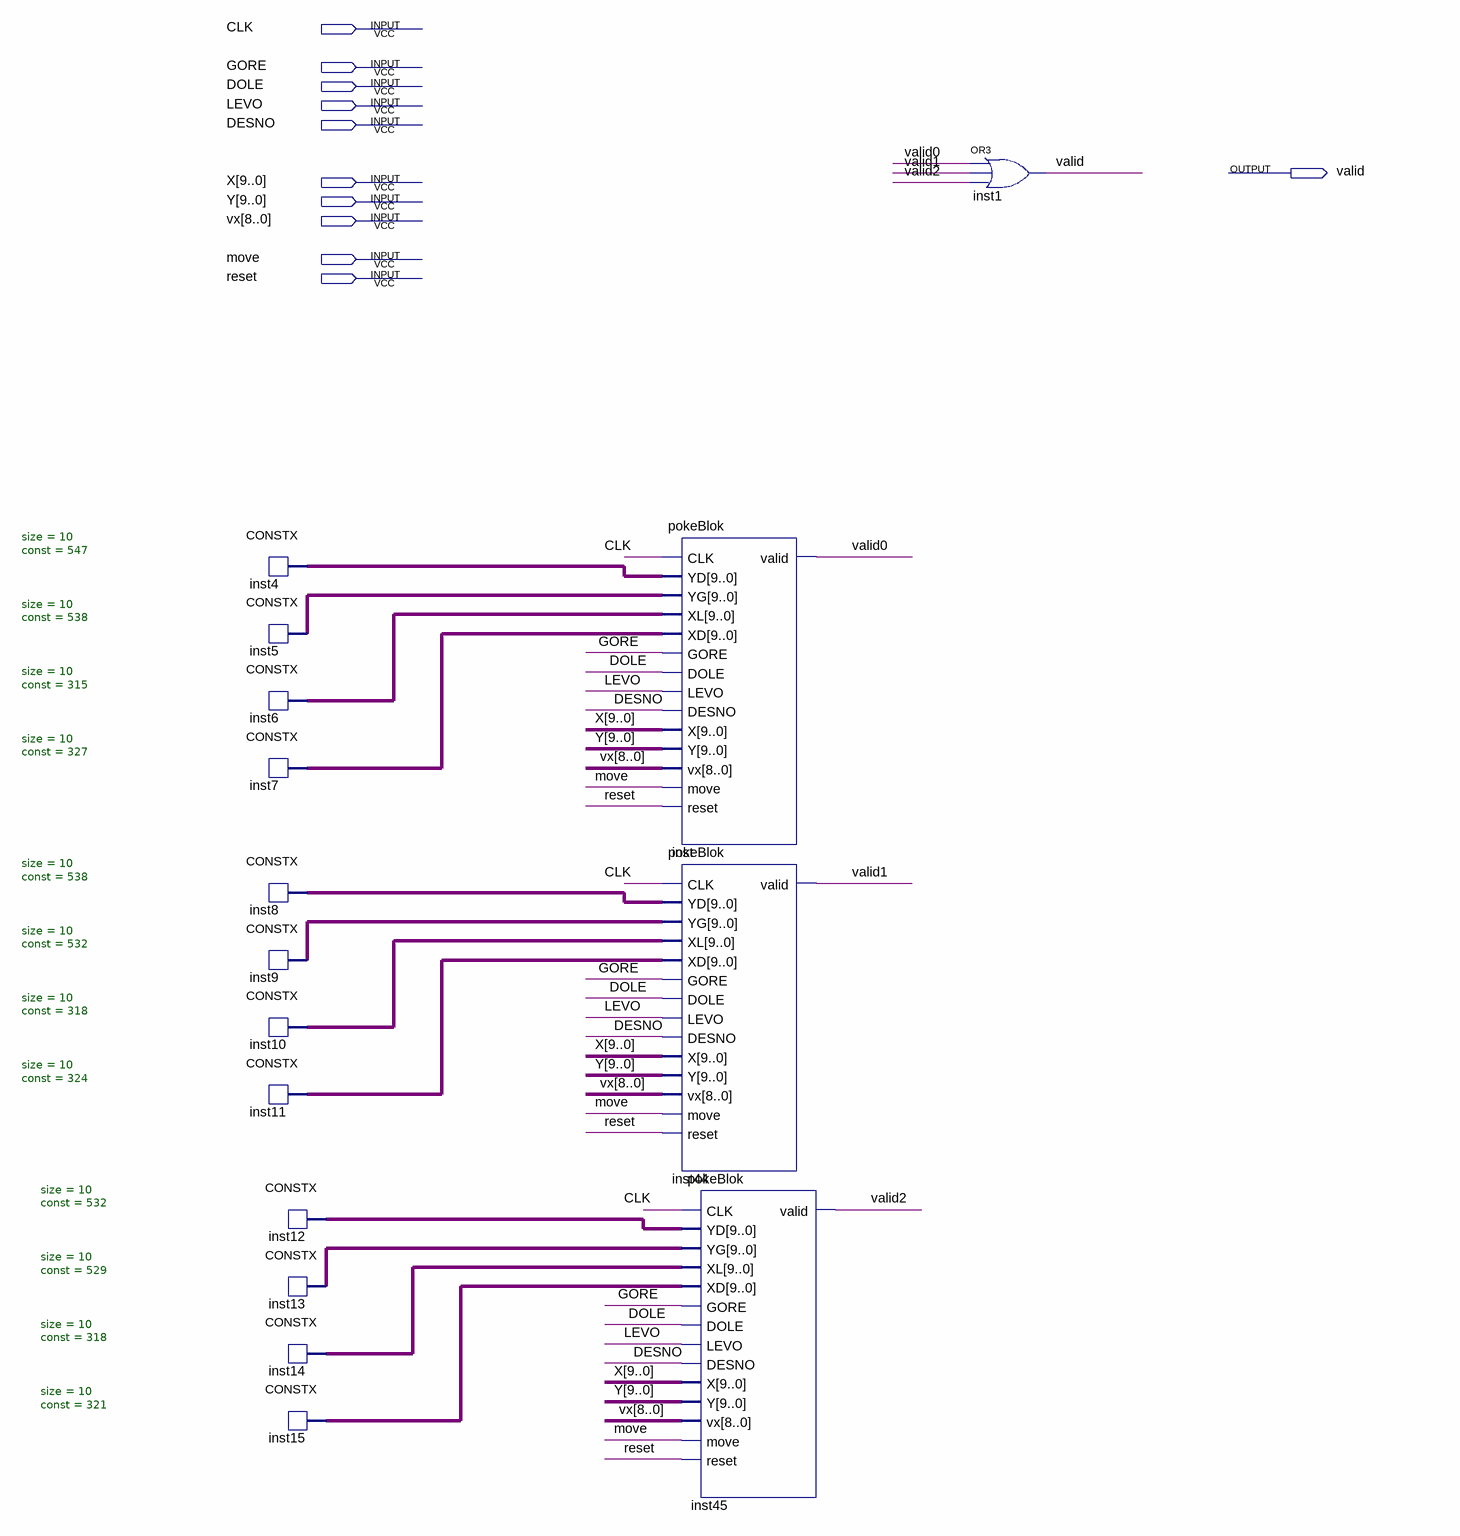
[diagram p0: schematic sheet]
// Quartus schematic crveniPokeBlok2.bdf as structural Verilog: 16 symbols, 11 pins
module crveniPokeBlok2 (
  input  CLK,
  input  GORE,
  input  DOLE,
  input  LEVO,
  input  DESNO,
  input  [9:0] X,
  input  [9:0] Y,
  input  [8:0] vx,
  input  move,
  input  reset,
  output valid
);

  wire valid0, valid1, valid2;
  wire [9:0] inst4_data, inst5_data, inst6_data, inst7_data, inst8_data, inst9_data, inst10_data,
       inst11_data, inst12_data, inst13_data, inst14_data, inst15_data;

  CONSTX #(.size(10), .\const (547)) inst4 (.data(inst4_data));
  CONSTX #(.size(10), .\const (538)) inst5 (.data(inst5_data));
  CONSTX #(.size(10), .\const (315)) inst6 (.data(inst6_data));
  CONSTX #(.size(10), .\const (327)) inst7 (.data(inst7_data));
  CONSTX #(.size(10), .\const (538)) inst8 (.data(inst8_data));
  CONSTX #(.size(10), .\const (532)) inst9 (.data(inst9_data));
  CONSTX #(.size(10), .\const (318)) inst10 (.data(inst10_data));
  CONSTX #(.size(10), .\const (324)) inst11 (.data(inst11_data));
  CONSTX #(.size(10), .\const (532)) inst12 (.data(inst12_data));
  CONSTX #(.size(10), .\const (529)) inst13 (.data(inst13_data));
  CONSTX #(.size(10), .\const (318)) inst14 (.data(inst14_data));
  CONSTX #(.size(10), .\const (321)) inst15 (.data(inst15_data));
  pokeBlok inst (
    .CLK(CLK), .YD(inst4_data), .YG(inst5_data), .XL(inst6_data), .XD(inst7_data), .GORE(GORE), .DOLE(DOLE),
    .LEVO(LEVO), .DESNO(DESNO), .X(X), .Y(Y), .vx(vx), .move(move), .reset(reset), .valid(valid0));
  pokeBlok inst44 (
    .CLK(CLK), .YD(inst8_data), .YG(inst9_data), .XL(inst10_data), .XD(inst11_data), .GORE(GORE),
    .DOLE(DOLE), .LEVO(LEVO), .DESNO(DESNO), .X(X), .Y(Y), .vx(vx), .move(move), .reset(reset), .valid(valid1));
  pokeBlok inst45 (
    .CLK(CLK), .YD(inst12_data), .YG(inst13_data), .XL(inst14_data), .XD(inst15_data), .GORE(GORE),
    .DOLE(DOLE), .LEVO(LEVO), .DESNO(DESNO), .X(X), .Y(Y), .vx(vx), .move(move), .reset(reset), .valid(valid2));
  or inst1 (valid, valid0, valid1, valid2);
endmodule
